# Altium schematic sheet Private DDR.schdoc
size 469 x 331 mm
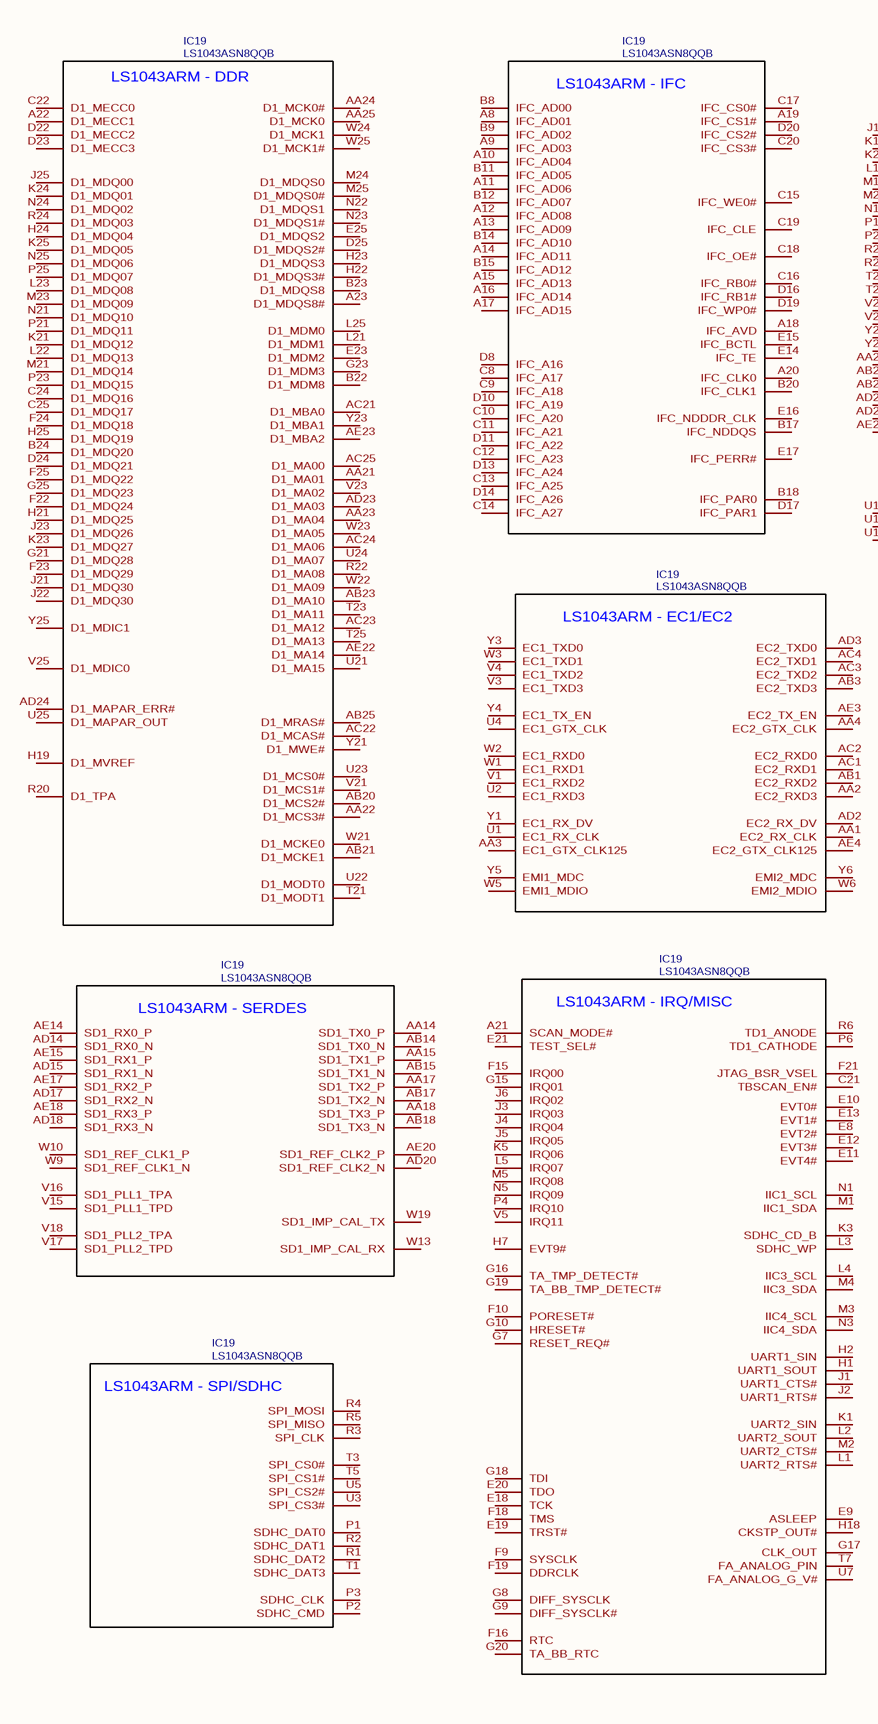
[diagram p0: Private DDR.schdoc, left]
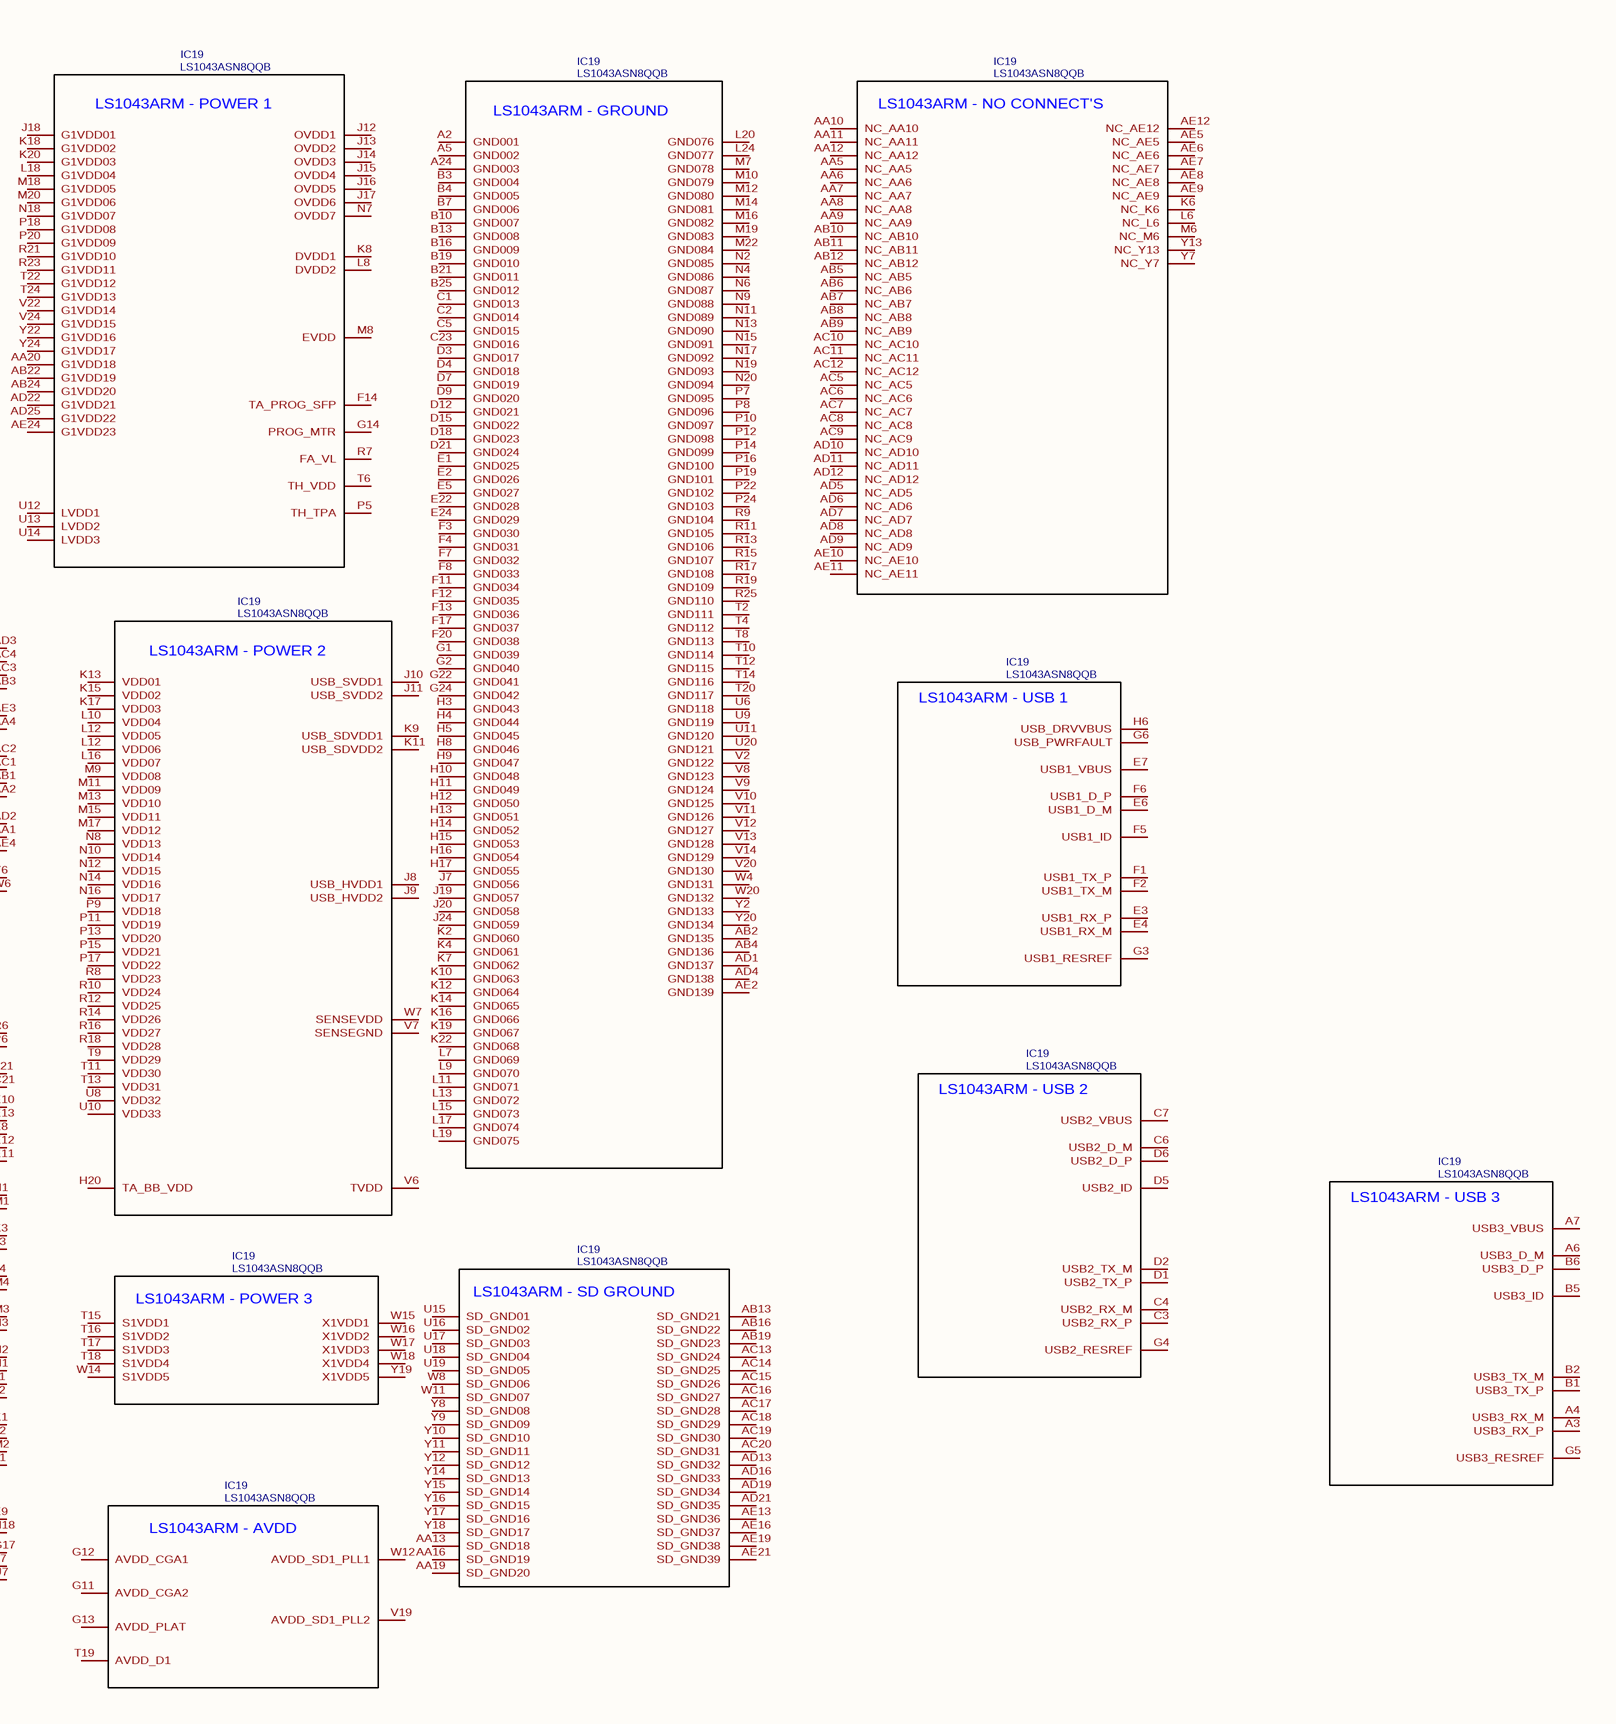
[diagram p1: Private DDR.schdoc, right]

## Parts
(Parts that share a designator on the sheet are numbered #1, #2 ... from top to bottom, then left to right.)
IC19#1  LS1043ASN8QQB  [BGA621C65P25X25_1700X1700X218N]
IC19#2  LS1043ASN8QQB  [BGA621C65P25X25_1700X1700X218N]
IC19#3  LS1043ASN8QQB  [BGA621C65P25X25_1700X1700X218N]
IC19#4  LS1043ASN8QQB  [BGA621C65P25X25_1700X1700X218N]
IC19#5  LS1043ASN8QQB  [BGA621C65P25X25_1700X1700X218N]
IC19#6  LS1043ASN8QQB  [BGA621C65P25X25_1700X1700X218N]
IC19#7  LS1043ASN8QQB  [BGA621C65P25X25_1700X1700X218N]
IC19#8  LS1043ASN8QQB  [BGA621C65P25X25_1700X1700X218N]
IC19#9  LS1043ASN8QQB  [BGA621C65P25X25_1700X1700X218N]
IC19#10  LS1043ASN8QQB  [BGA621C65P25X25_1700X1700X218N]
IC19#11  LS1043ASN8QQB  [BGA621C65P25X25_1700X1700X218N]
IC19#12  LS1043ASN8QQB  [BGA621C65P25X25_1700X1700X218N]
IC19#13  LS1043ASN8QQB  [BGA621C65P25X25_1700X1700X218N]
IC19#14  LS1043ASN8QQB  [BGA621C65P25X25_1700X1700X218N]
IC19#15  LS1043ASN8QQB  [BGA621C65P25X25_1700X1700X218N]
IC19#16  LS1043ASN8QQB  [BGA621C65P25X25_1700X1700X218N]

## Nets

Not connected (* = marked no-connect by the designer): IC19#1 A8(IFC_AD01) A9(IFC_AD03) A10(IFC_AD04) A11(IFC_AD06) A12(IFC_AD08) A13(IFC_AD09) A14(IFC_AD11) A15(IFC_AD13) A16(IFC_AD14) A17(IFC_AD15) A18(IFC_AVD) A19(IFC_CS1#) A20(IFC_CLK0) B8(IFC_AD00) B9(IFC_AD02) B11(IFC_AD05) B12(IFC_AD07) B14(IFC_AD10) B15(IFC_AD12) B17(IFC_NDDQS) B18(IFC_PAR0) B20(IFC_CLK1) C8(IFC_A17) C9(IFC_A18) C10(IFC_A20) C11(IFC_A21) C12(IFC_A23) C13(IFC_A25) C14(IFC_A27) C15(IFC_WE0#) C16(IFC_RB0#) C17(IFC_CS0#) C18(IFC_OE#) C19(IFC_CLE) C20(IFC_CS3#) D8(IFC_A16) D10(IFC_A19) D11(IFC_A22) D13(IFC_A24) D14(IFC_A26) D16(IFC_RB1#) D17(IFC_PAR1) D19(IFC_WP0#) D20(IFC_CS2#) E14(IFC_TE) E15(IFC_BCTL) E16(IFC_NDDDR_CLK) E17(IFC_PERR#); IC19#2 AA20(G1VDD18) AB22(G1VDD19) AB24(G1VDD20) AD22(G1VDD21) AD25(G1VDD22) AE24(G1VDD23) F14(TA_PROG_SFP) G14(PROG_MTR) J12(OVDD1) J13(OVDD2) J14(OVDD3) J15(OVDD4) J16(OVDD5) J17(OVDD6) J18(G1VDD01) K8(DVDD1) K18(G1VDD02) K20(G1VDD03) L8(DVDD2) L18(G1VDD04) M8(EVDD) M18(G1VDD05) M20(G1VDD06) N7(OVDD7) N18(G1VDD07) P5(TH_TPA) P18(G1VDD08) P20(G1VDD09) R7(FA_VL) R21(G1VDD10) R23(G1VDD11) T6(TH_VDD) T22(G1VDD12) T24(G1VDD13) U12(LVDD1) U13(LVDD2) U14(LVDD3) V22(G1VDD14) V24(G1VDD15) Y22(G1VDD16) Y24(G1VDD17); IC19#3 AA5(NC_AA5) AA6(NC_AA6) AA7(NC_AA7) AA8(NC_AA8) AA9(NC_AA9) AA10(NC_AA10) AA11(NC_AA11) AA12(NC_AA12) AB5(NC_AB5) AB6(NC_AB6) AB7(NC_AB7) AB8(NC_AB8) AB9(NC_AB9) AB10(NC_AB10) AB11(NC_AB11) AB12(NC_AB12) AC5(NC_AC5) AC6(NC_AC6) AC7(NC_AC7) AC8(NC_AC8) AC9(NC_AC9) AC10(NC_AC10) AC11(NC_AC11) AC12(NC_AC12) AD5(NC_AD5) AD6(NC_AD6) AD7(NC_AD7) AD8(NC_AD8) AD9(NC_AD9) AD10(NC_AD10) AD11(NC_AD11) AD12(NC_AD12) AE5(NC_AE5) AE6(NC_AE6) AE7(NC_AE7) AE8(NC_AE8) AE9(NC_AE9) AE10(NC_AE10) AE11(NC_AE11) AE12(NC_AE12) K6(NC_K6) L6(NC_L6) M6(NC_M6) Y7(NC_Y7) Y13(NC_Y13); IC19#4 AA1(EC2_RX_CLK) AA2(EC2_RXD3) AA3(EC1_GTX_CLK125) AA4(EC2_GTX_CLK) AB1(EC2_RXD2) AB3(EC2_TXD3) AC1(EC2_RXD1) AC2(EC2_RXD0) AC3(EC2_TXD2) AC4(EC2_TXD1) AD2(EC2_RX_DV) AD3(EC2_TXD0) AE3(EC2_TX_EN) AE4(EC2_GTX_CLK125) U1(EC1_RX_CLK) U2(EC1_RXD3) U4(EC1_GTX_CLK) V1(EC1_RXD2) V3(EC1_TXD3) V4(EC1_TXD2) W1(EC1_RXD1) W2(EC1_RXD0) W3(EC1_TXD1) W5(EMI1_MDIO) W6(EMI2_MDIO) Y1(EC1_RX_DV) Y3(EC1_TXD0) Y4(EC1_TX_EN) Y5(EMI1_MDC) Y6(EMI2_MDC); IC19#5 A22(D1_MECC1) A23(D1_MDQS8#) AA21(D1_MA01) AA22(D1_MCS3#) AA23(D1_MA04) AA24(D1_MCK0#) AA25(D1_MCK0) AB20(D1_MCS2#) AB21(D1_MCKE1) AB23(D1_MA10) AB25(D1_MRAS#) AC21(D1_MBA0) AC22(D1_MCAS#) AC23(D1_MA12) AC24(D1_MA06) AC25(D1_MA00) AD23(D1_MA03) AD24(D1_MAPAR_ERR#) AE22(D1_MA14) AE23(D1_MBA2) B22(D1_MDM8) B23(D1_MDQS8) B24(D1_MDQ20) C22(D1_MECC0) C24(D1_MDQ16) C25(D1_MDQ17) D22(D1_MECC2) D23(D1_MECC3) D24(D1_MDQ21) D25(D1_MDQS2#) E23(D1_MDM2) E25(D1_MDQS2) F22(D1_MDQ24) F23(D1_MDQ29) F24(D1_MDQ18) F25(D1_MDQ22) G21(D1_MDQ28) G23(D1_MDM3) G25(D1_MDQ23) H19(D1_MVREF) H21(D1_MDQ25) H22(D1_MDQS3#) H23(D1_MDQS3) H24(D1_MDQ04) H25(D1_MDQ19) J21(D1_MDQ30) J22(D1_MDQ30) J23(D1_MDQ26) J25(D1_MDQ00) K21(D1_MDQ12) K23(D1_MDQ27) K24(D1_MDQ01) K25(D1_MDQ05) L21(D1_MDM1) L22(D1_MDQ13) L23(D1_MDQ08) L25(D1_MDM0) M21(D1_MDQ14) M23(D1_MDQ09) M24(D1_MDQS0) M25(D1_MDQS0#) N21(D1_MDQ10) N22(D1_MDQS1) N23(D1_MDQS1#) N24(D1_MDQ02) N25(D1_MDQ06) P21(D1_MDQ11) P23(D1_MDQ15) P25(D1_MDQ07) R20(D1_TPA) R22(D1_MA08) R24(D1_MDQ03) T21(D1_MODT1) T23(D1_MA11) T25(D1_MA13) U21(D1_MA15) U22(D1_MODT0) U23(D1_MCS0#) U24(D1_MA07) U25(D1_MAPAR_OUT) V21(D1_MCS1#) V23(D1_MA02) V25(D1_MDIC0) W21(D1_MCKE0) W22(D1_MA09) W23(D1_MA05) W24(D1_MCK1) W25(D1_MCK1#) Y21(D1_MWE#) Y23(D1_MBA1) Y25(D1_MDIC1); IC19#6 E3(USB1_RX_P) E4(USB1_RX_M) E6(USB1_D_M) E7(USB1_VBUS) F1(USB1_TX_P) F2(USB1_TX_M) F5(USB1_ID) F6(USB1_D_P) G3(USB1_RESREF) G6(USB_PWRFAULT) H6(USB_DRVVBUS); IC19#7 A2(GND001) A5(GND002) A24(GND003) AB2(GND135) AB4(GND136) AD1(GND137) AD4(GND138) AE2(GND139) B3(GND004) B4(GND005) B7(GND006) B10(GND007) B13(GND008) B16(GND009) B19(GND010) B21(GND011) B25(GND012) C1(GND013) C2(GND014) C5(GND015) C23(GND016) D3(GND017) D4(GND018) D7(GND019) D9(GND020) D12(GND021) D15(GND022) D18(GND023) D21(GND024) E1(GND025) E2(GND026) E5(GND027) E22(GND028) E24(GND029) F3(GND030) F4(GND031) F7(GND032) F8(GND033) F11(GND034) F12(GND035) F13(GND036) F17(GND037) F20(GND038) G1(GND039) G2(GND040) G22(GND041) G24(GND042) H3(GND043) H4(GND044) H5(GND045) H8(GND046) H9(GND047) H10(GND048) H11(GND049) H12(GND050) H13(GND051) H14(GND052) H15(GND053) H16(GND054) H17(GND055) J7(GND056) J19(GND057) J20(GND058) J24(GND059) K2(GND060) K4(GND061) K7(GND062) K10(GND063) K12(GND064) K14(GND065) K16(GND066) K19(GND067) K22(GND068) L7(GND069) L9(GND070) L11(GND071) L13(GND072) L15(GND073) L17(GND074) L19(GND075) L20(GND076) L24(GND077) M7(GND078) M10(GND079) M12(GND080) M14(GND081) M16(GND082) M19(GND083) M22(GND084) N2(GND085) N4(GND086) N6(GND087) N9(GND088) N11(GND089) N13(GND090) N15(GND091) N17(GND092) N19(GND093) N20(GND094) P7(GND095) P8(GND096) P10(GND097) P12(GND098) P14(GND099) P16(GND100) P19(GND101) P22(GND102) P24(GND103) R9(GND104) R11(GND105) R13(GND106) R15(GND107) R17(GND108) R19(GND109) R25(GND110) T2(GND111) T4(GND112) T8(GND113) T10(GND114) T12(GND115) T14(GND116) T20(GND117) U6(GND118) U9(GND119) U11(GND120) U20(GND121) V2(GND122) V8(GND123) V9(GND124) V10(GND125) V11(GND126) V12(GND127) V13(GND128) V14(GND129) V20(GND130) W4(GND131) W20(GND132) Y2(GND133) Y20(GND134); IC19#8 H20(TA_BB_VDD) J8(USB_HVDD1) J9(USB_HVDD2) J10(USB_SVDD1) J11(USB_SVDD2) K9(USB_SDVDD1) K11(USB_SDVDD2) K13(VDD01) K15(VDD02) K17(VDD03) L10(VDD04) L12(VDD05) L16(VDD07) M9(VDD08) M11(VDD09) M13(VDD10) M15(VDD11) M17(VDD12) N8(VDD13) N10(VDD14) N12(VDD15) N14(VDD16) N16(VDD17) P9(VDD18) P11(VDD19) P13(VDD20) P15(VDD21) P17(VDD22) R8(VDD23) R10(VDD24) R12(VDD25) R14(VDD26) R16(VDD27) R18(VDD28) T9(VDD29) T11(VDD30) T13(VDD31) U8(VDD32) U10(VDD33) V6(TVDD) V7(SENSEGND) W7(SENSEVDD); IC19#9 AA14(SD1_TX0_P) AA15(SD1_TX1_P) AA17(SD1_TX2_P) AA18(SD1_TX3_P) AB14(SD1_TX0_N) AB15(SD1_TX1_N) AB17(SD1_TX2_N) AB18(SD1_TX3_N) AD14(SD1_RX0_N) AD15(SD1_RX1_N) AD17(SD1_RX2_N) AD18(SD1_RX3_N) AD20(SD1_REF_CLK2_N) AE14(SD1_RX0_P) AE15(SD1_RX1_P) AE17(SD1_RX2_P) AE18(SD1_RX3_P) AE20(SD1_REF_CLK2_P) V15(SD1_PLL1_TPD) V16(SD1_PLL1_TPA) V17(SD1_PLL2_TPD) V18(SD1_PLL2_TPA) W9(SD1_REF_CLK1_N) W10(SD1_REF_CLK1_P) W13(SD1_IMP_CAL_RX) W19(SD1_IMP_CAL_TX); IC19#10 T15(S1VDD1) T16(S1VDD2) T17(S1VDD3) T18(S1VDD4) W14(S1VDD5) W15(X1VDD1) W16(X1VDD2) W17(X1VDD3) W18(X1VDD4) Y19(X1VDD5); IC19#11 C3(USB2_RX_P) C4(USB2_RX_M) C6(USB2_D_M) C7(USB2_VBUS) D1(USB2_TX_P) D2(USB2_TX_M) D5(USB2_ID) D6(USB2_D_P) G4(USB2_RESREF); IC19#12 A3(USB3_RX_P) A4(USB3_RX_M) A6(USB3_D_M) A7(USB3_VBUS) B1(USB3_TX_P) B2(USB3_TX_M) B5(USB3_ID) B6(USB3_D_P) G5(USB3_RESREF); IC19#13 AA13(SD_GND18) AA16(SD_GND19) AA19(SD_GND20) AB13(SD_GND21) AB16(SD_GND22) AB19(SD_GND23) AC13(SD_GND24) AC14(SD_GND25) AC15(SD_GND26) AC16(SD_GND27) AC17(SD_GND28) AC18(SD_GND29) AC19(SD_GND30) AC20(SD_GND31) AD13(SD_GND32) AD16(SD_GND33) AD19(SD_GND34) AD21(SD_GND35) AE13(SD_GND36) AE16(SD_GND37) AE19(SD_GND38) AE21(SD_GND39) U15(SD_GND01) U16(SD_GND02) U17(SD_GND03) U18(SD_GND04) U19(SD_GND05) W8(SD_GND06) W11(SD_GND07) Y8(SD_GND08) Y9(SD_GND09) Y10(SD_GND10) Y11(SD_GND11) Y12(SD_GND12) Y14(SD_GND13) Y15(SD_GND14) Y16(SD_GND15) Y17(SD_GND16) Y18(SD_GND17); IC19#14 P1(SDHC_DAT0) P2(SDHC_CMD) P3(SDHC_CLK) R1(SDHC_DAT2) R2(SDHC_DAT1) R3(SPI_CLK) R4(SPI_MOSI) R5(SPI_MISO) T1(SDHC_DAT3) T3(SPI_CS0#) T5(SPI_CS1#) U3(SPI_CS3#) U5(SPI_CS2#); IC19#15 A21(SCAN_MODE#) C21(TBSCAN_EN#) E8(EVT2#) E9(ASLEEP) E10(EVT0#) E11(EVT4#) E12(EVT3#) E13(EVT1#) E18(TCK) E19(TRST#) E20(TDO) E21(TEST_SEL#) F9(SYSCLK) F10(PORESET#) F15(IRQ00) F16(RTC) F18(TMS) F19(DDRCLK) F21(JTAG_BSR_VSEL) G7(RESET_REQ#) G8(DIFF_SYSCLK) G9(DIFF_SYSCLK#) G10(HRESET#) G15(IRQ01) G16(TA_TMP_DETECT#) G17(CLK_OUT) G18(TDI) G19(TA_BB_TMP_DETECT#) G20(TA_BB_RTC) H1(UART1_SOUT) H2(UART1_SIN) H7(EVT9#) H18(CKSTP_OUT#) J1(UART1_CTS#) J2(UART1_RTS#) J3(IRQ03) J4(IRQ04) J5(IRQ05) J6(IRQ02) K1(UART2_SIN) K3(SDHC_CD_B) K5(IRQ06) L1(UART2_RTS#) L2(UART2_SOUT) L3(SDHC_WP) L4(IIC3_SCL) L5(IRQ07) M1(IIC1_SDA) M2(UART2_CTS#) M3(IIC4_SCL) M4(IIC3_SDA) M5(IRQ08) N1(IIC1_SCL) N3(IIC4_SDA) N5(IRQ09) P4(IRQ10) P6(TD1_CATHODE) R6(TD1_ANODE) T7(FA_ANALOG_PIN) U7(FA_ANALOG_G_V#) V5(IRQ11); IC19#16 G11(AVDD_CGA2) G12(AVDD_CGA1) G13(AVDD_PLAT) T19(AVDD_D1) V19(AVDD_SD1_PLL2) W12(AVDD_SD1_PLL1)

## Notes on the sheet
- (in symbol LS1043ASN8QQB) LS1043ARM - SERDES; LS1043ARM - SPI/SDHC; LS1043ARM - IFC; LS1043ARM - EC1/EC2; LS1043ARM - IRQ/MISC; LS1043ARM - POWER 1; LS1043ARM - POWER 2; LS1043ARM - POWER 3; LS1043ARM - GROUND; LS1043ARM - SD GROUND; LS1043ARM - AVDD; LS1043ARM - NO CONNECT'S; LS1043ARM - USB 1; LS1043ARM - USB 2; LS1043ARM - USB 3; LS1043ARM - DDR

## Library data of the parts
IC19#1-IC19#16 = LS1043ASN8QQB: subpart_no: 1; Contributor: Ke'Ondrae_Mell; spicePre: I; spiceSymbolName: LS1043ASN8QQB